# EAGLE design DeepReset2 (EAGLE 9.4.0)
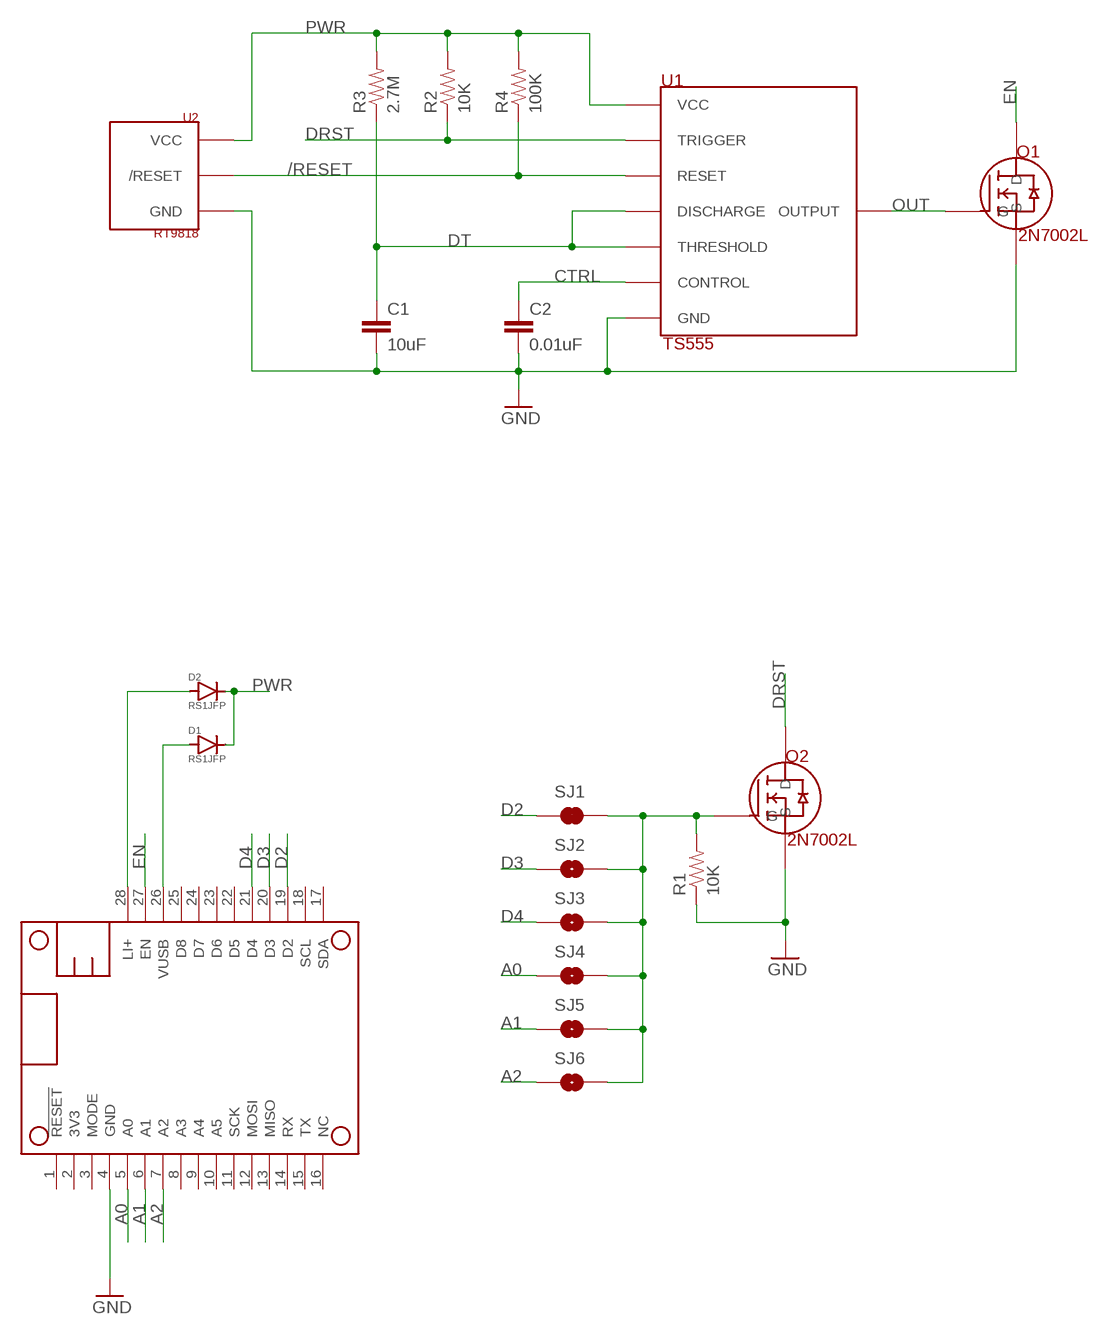
[diagram p0: schematic, sheet 1]

## Parts
C1  10uF  CAP-10UF-0603  [0603-CAP]
C2  0.01uF  CAP-0.01UF-0603  [0603-CAP]
D1  RS1JFP  DIODE-RS1JFP  [SOD-123HE-ON]
D2  RS1JFP  DIODE-RS1JFP  [SOD-123HE-ON]
MS1  FEATHERWING_NODIM  [FEATHERWING_NODIM]
Q1  2N7002L  [2N7002L]
Q2  2N7002L  [2N7002L]
R1  10K  RES-10K-06030603  [0603-RES]
R2  10K  RES-10K-06030603  [0603-RES]
R3  2.7M  RES-2.7M-0603  [0603-RES]
R4  100K  RES-100K-0603  [0603-RES]
SJ1  JUMPER-PAD-2-NC_BY_TRACENO_SILK  [PAD-JUMPER-2-NC_BY_TRACE_NO_SILK]
SJ2  JUMPER-PAD-2-NO  [PAD-JUMPER-2-NO_NO_SILK]
SJ3  JUMPER-PAD-2-NO  [PAD-JUMPER-2-NO_NO_SILK]
SJ4  JUMPER-PAD-2-NO  [PAD-JUMPER-2-NO_NO_SILK]
SJ5  JUMPER-PAD-2-NO  [PAD-JUMPER-2-NO_NO_SILK]
SJ6  JUMPER-PAD-2-NO  [PAD-JUMPER-2-NO_NO_SILK]
U1  TS555  [8-SOIC-MICROCHIP-3.9]
U2  RT9818  [SOT-23-3]

## Nets
/RESET: R4.1 U1.4(RESET) U2.1(/RESET)
A0: MS1.5(A0) SJ4.1
A1: MS1.6(A1) SJ5.1
A2: MS1.7(A2) SJ6.1
AD: Q2.1(G) R1.2 SJ1.2 SJ2.2 SJ3.2 SJ4.2 SJ5.2 SJ6.2
CTRL: C2.1 U1.5(CONTROL)
D2: MS1.19(D2) SJ1.1
D3: MS1.20(D3) SJ2.1
D4: MS1.21(D4) SJ3.1
DRST: Q2.3(D) R2.1 U1.2(TRIGGER)
DT: C1.1 R3.1 U1.6(THRESHOLD) U1.7(DISCHARGE)
EN: MS1.27(EN) Q1.3(D)
GND: C1.2 C2.2 MS1.4(GND) Q1.2(S) Q2.2(S) R1.1 U1.1(GND) U2.2(GND)
LI+: D2.2(ANODE) MS1.28(LI+)
OUT: Q1.1(G) U1.3(OUTPUT)
PWR: D1.1(CATHODE) D2.1(CATHODE) R2.2 R3.2 R4.2 U1.8(VCC) U2.3(VCC)
VUSB: D1.2(ANODE) MS1.26(VUSB)
Unconnected: MS1.1(!RESET) MS1.2(3V3) MS1.3(MODE) MS1.8(A3) MS1.9(A4) MS1.10(A5) MS1.11(SCK) MS1.12(MOSI) MS1.13(MISO) MS1.14(RX) MS1.15(TX) MS1.16(NC) MS1.17(SDA) MS1.18(SCL) MS1.22(D5) MS1.23(D6) MS1.24(D7) MS1.25(D8)

## Library data of the parts
C1 = rickk2:CAP-10UF-0603: CAP CER 10UF 16V X5R 0805 $ 0.21 https://www.digikey.com/product-detail/en/murata-electronics-north-america/GRM21BR61C106KE15L/490-3886-1-ND/965928
C2 = rickk2:CAP-0.01UF-0603: CAP CER 10000PF 100V X7R 0603 10000 pF = 10 nF = 0.01 uF https://www.digikey.com/product-detail/en/murata-electronics-north-america/GCM188R72A103KA37J/490-8028-1-ND/4380313
D1 D2 = rickk2:DIODE-RS1JFP: Reverse voltage protection diode ON Semiconductor RS1JFP $0.44 DIODE GP 600V 1.2A SOD123HE Diode Standard 600V 1.2A Surface Mount SOD-123HE https://www.digikey.com/product-detail/en/on-semiconductor/RS1JFP/RS1JFPCT-ND/5722970 Ordered 20 2019-04-01 Used in Ford open power supply 1=Cathode=Large Pad=side with band 2=Anode=Small Pad
MS1 = Particle-Mesh:FEATHERWING
Q1 Q2 = rickk2:2N7002L: MOSFET N-CH 60V 0.115A SOT-23 $ 0.16 On Semicondutor 2N7002LT1G N-Channel 115mA (Tc) 225mW (Ta) Surface Mount SOT-23-3 (TO-236) https://www.digikey.com/product-detail/en/on-semiconductor/2N7002LT3G/2N7002LT3GOSCT-ND/2704932 1=G, high=D is connected to S (GND), the "on" state 2=S to GND (bottom of symbol) 3=D to load (top of symbol, pin on the side by itself) 2A version: Diodes Inc DMN6075S-7 MOSFET N-CH 60V 2A SOT23-3 $0.45 https://www.digikey.com/product-detail/en/diodes-incorporated/DMN6075S-7/DMN6075S-7DICT-ND/5149299 Old: https://www.digikey.com/product-detail/en/on-semiconductor/2N7002LT1G/2N7002LT1GOSCT-ND/917791
R1 R2 = rickk2:RES-10K-0603: RES SMD 10K OHM 5% 1/4W 0603 $ 0.10 https://www.digikey.com/product-detail/en/panasonic-electronic-components/ERJ-PA3J103V/P10KBZCT-ND/5036237
R3 = rickk2:RES-2.7M-0603: Panasonic Electronic Components ERJ-3GEYJ275V RES SMD 2.7M OHM 5% 1/10W 0603 2.7 MOhms ±5% 0.1W, 1/10W Chip Resistor 0603 (1608 Metric) Automotive AEC-Q200 Thick Film https://www.digikey.com/product-detail/en/panasonic-electronic-components/ERJ-3GEYJ275V/P2.7MGCT-ND/282431
R4 = rickk2:RES-100K-0603: 100 kOhms ±1% 0.1W, 1/10W Chip Resistor 0603 (1608 Metric) Automotive AEC-Q200 Thick Film https://www.digikey.com/product-detail/en/panasonic-electronic-components/ERJ-3EKF1003V/P100KHCT-ND/198110 Old: RES SMD 100K OHM 1% 1/4W 0603 $ 0.16 Panasonic ERJ-PA3F1003V ±1% 0.25W, 1/4W Chip Resistor 0603 (1608 Metric) Automotive AEC-Q200, Pulse Withstanding Thick Film https://www.digikey.com/product-detail/en/panasonic-electronic-components/ERJ-PA3F1003V/P100KBYCT-ND/5036116
SJ1 = rickk2:JUMPER-PAD-2-NC_BY_TRACE
SJ2-SJ6 = rickk2:JUMPER-PAD-2-NO
U1 = rickk2:TS555: STMicroelectronics TS555IDTTR $1.12 IC OSC SINGLE TIMER 2.7MHZ 8SOIC 555 Type, Timer/Oscillator (Single) IC 2.7MHz 8-SO https://www.digikey.com/product-detail/en/stmicroelectronics/TS555IDTTR/497-16404-1-ND/5959811
U2 = rickk2:RT9818: Richtek USA Inc. RT9818C-29GV $0.41 IC VOLT DETECTOR 2.9V SOT23-3 Supervisor Open Drain or Open Collector 1 Channel SOT-23-3 https://www.digikey.com/product-detail/en/richtek-usa-inc/RT9818C-29GV/1028-1020-1-ND/2470079 RT9818C-29GV C = 220 ms /RESET 29 = 2.9V G=Green (Halogen and Pb Free) V = SOT23-3

## Board
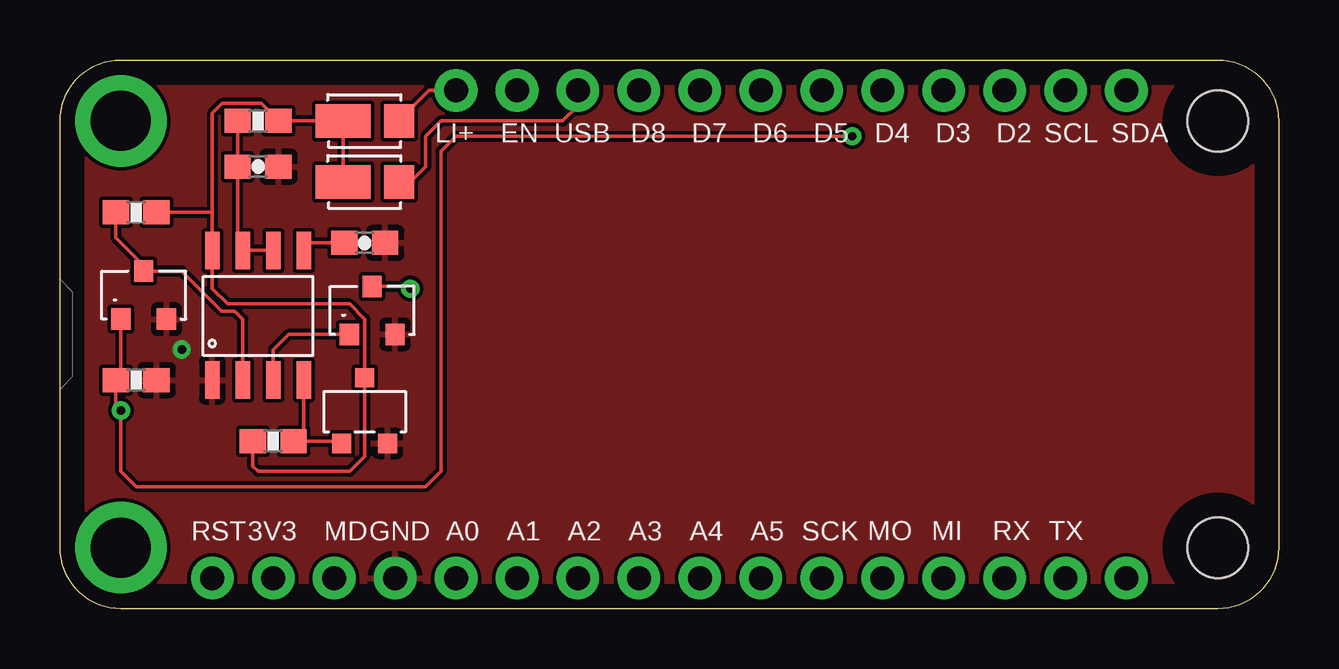
[diagram p1: board, top side]
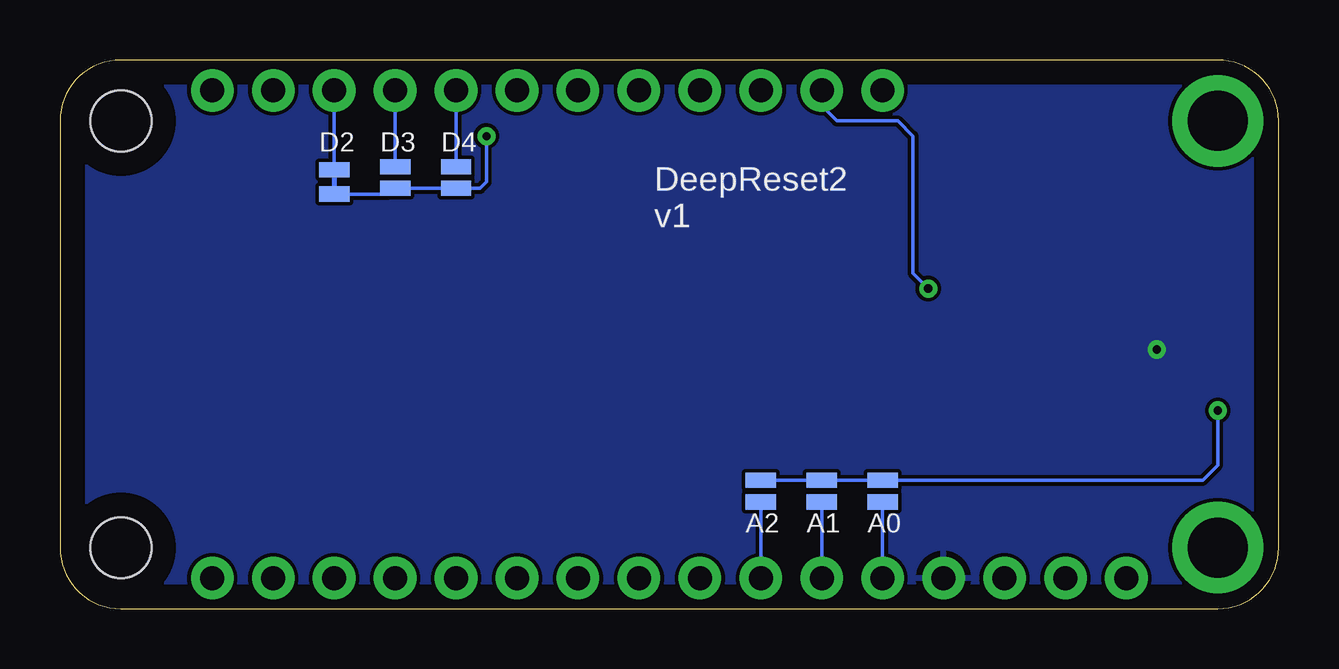
[diagram p2: board, bottom side, seen from below]

Size 50.8 x 22.86 mm. Coordinates in mm from the lower left corner, seen from the top.
Outline: 2.54,22.86 48.26,22.86 arc-90 50.8,20.32 50.8,2.54 arc-90 48.26,0 2.54,0 arc-90 0,2.54 0,20.32 arc-90 2.54,22.86
Copper layers (1*16): Top 0.035mm / dielectric 1.5mm / Bottom 0.035mm
Design rules "default": minimum track width 6mil, minimum drill 0.35mm, track to track 6mil, track to pad 6mil, pad to pad 6mil, via to via 6mil, smd to smd 6mil, copper to edge 40mil, drill to drill 6mil, minimum pad ring 10mil, minimum via ring 8mil, stop-mask expansion 4mil, vias tented up to drill 0mil, thermal gap 10mil

### Footprints (pad centres in the part's own frame; a part is rotated, then mirrored left to right if it is on the bottom)
0603-CAP = smd 1.1 x 1: 1 -0.85,0; 2 0.85,0
SOD-123HE-ON = smd 2.3 x 1.4: 1 -0.9,0 | smd 1.25 x 1.4: 2 1.425,0
FEATHERWING_NODIM = drill 1 pad 1.778: 1 6.35,1.27; 2 8.89,1.27; 3 11.43,1.27; 4 13.97,1.27; 5 16.51,1.27; 6 19.05,1.27; 7 21.59,1.27; 8 24.13,1.27; 9 26.67,1.27; 10 29.21,1.27; 11 31.75,1.27; 12 34.29,1.27; 13 36.83,1.27; 14 39.37,1.27; 15 41.91,1.27; 16 44.45,1.27; 17 44.45,21.59; 18 41.91,21.59; 19 39.37,21.59; 20 36.83,21.59; 21 34.29,21.59; 22 31.75,21.59; 23 29.21,21.59; 24 26.67,21.59; 25 24.13,21.59; 26 21.59,21.59; 27 19.05,21.59; 28 16.51,21.59 | drill 2.5 pad 3.81: P$1 2.54,20.32; P$2 2.54,2.54 | hole 2.54: 48.26,20.32; 48.26,2.54
2N7002L = smd 0.8 x 0.9: 1 0,0; 2 1.9,0; 3 0.95,2
0603-RES = smd 1.1 x 1: 1 -0.85,0; 2 0.85,0
PAD-JUMPER-2-NC_BY_TRACE_NO_SILK = smd 0.635 x 1.27: 1 -0.508,0; 2 0.508,0
PAD-JUMPER-2-NO_NO_SILK = smd 0.635 x 1.27: 1 -0.45,0; 2 0.45,0
8-SOIC-MICROCHIP-3.9 = smd 0.6 x 1.55: 1 0,0; 2 1.27,0; 3 2.54,0; 4 3.81,0; 5 3.81,5.4; 6 2.54,5.4; 7 1.27,5.4; 8 0,5.4
SOT-23-3 = smd 0.8 x 0.8: 1 -0.96,-1.37; 2 0.96,-1.37; 3 0,1.37

### Placement (x,y rotation side)
C1  8.26,18.41 0 top
C2  12.7,15.24 0 top
D1  12.7,17.78 0 top
D2  12.7,20.32 0 top
MS1  0,0 0 top
Q1  12.06,11.43 0 top
Q2  2.54,12.06 0 top
R1  3.17,9.53 180 top
R2  3.17,16.51 0 top
R3  8.26,20.32 0 top
R4  8.89,6.99 180 top
SJ1  39.37,17.78 270 bottom
SJ2  36.83,17.96 270 bottom
SJ3  34.29,17.96 270 bottom
SJ4  16.51,4.89 90 bottom
SJ5  19.05,4.89 90 bottom
SJ6  21.59,4.89 90 bottom
U1  6.35,9.53 0 top
U2  12.7,8.26 0 top

### Tracks (layer width: path | path; a pad name or v marks a point on that pad's centre or on a via)
/RESET
  Top 0.152: U2.1 11.64,6.99 R4.1 10.16,7.41 U1.4
A0
  Bottom 0.152: SJ4.1 MS1.5
A1
  Bottom 0.152: SJ5.1 MS1.6
A2
  Bottom 0.152: SJ6.1 MS1.7
AD  (via drill 0.35)
  Top 0.152: Q2.1 2.54,9.74 R1.2 2.33,8.47 v2.54,8.26 2.54,5.71 3.17,5.08 15.24,5.08 15.88,5.71 15.88,19.05 16.51,19.68 v33.02,19.68
  Bottom 0.152: SJ1.2 37.07,17.27 SJ2.2 SJ3.2 33.28,17.52 33.02,17.78 v33.02,19.68 | SJ6.2 SJ5.2 SJ4.2 3.17,5.34 2.54,5.98 v2.54,8.26
CTRL
  Top 0.152: U1.5 10.47,15.24 C2.1
D2
  Bottom 0.152: SJ1.1 MS1.19
D3
  Bottom 0.152: MS1.20 SJ2.1
D4
  Bottom 0.152: MS1.21 SJ3.1
DRST
  Top 0.152: R2.1 2.33,15.46 3.49,14.29 Q2.3 5.08,14.06 6.75,12.39 7.29,12.39 7.62,12.06 U1.2
DT
  Top 0.152: U1.6 U1.7 7.41,15.14 C1.1 R3.1
EN  (via drill 0.35)
  Top 0.152: Q1.3 14.51,13.43 v14.61,13.34
  Bottom 0.152: MS1.27 19.05,20.95 18.41,20.32 15.88,20.32 15.24,19.68 15.24,13.97 v14.61,13.34
GND  (via drill 0.35)
  other vias: 5.08,10.79
  pour Top: 0,0 0,25.4 53.34,25.4 53.34,0
  pour Bottom: 0,0 0,27.94 50.8,27.94 50.8,0
LI+
  Top 0.152: D2.2 15.39,21.59 MS1.28
OUT
  Top 0.152: Q1.1 9.53,11.43 8.89,10.79 U1.3
PWR
  Top 0.152: D1.1 D2.1 R3.2 8.38,21.05 6.76,21.05 6.35,20.64 6.35,16.51 | 6.35,16.51 U1.8 6.35,13.34 6.99,12.7 12.06,12.7 12.7,12.06 U2.3 12.7,6.35 12.06,5.71 8.26,5.71 8.04,5.93 R4.2 8.04,6.57 | R2.2 6.35,16.51
VUSB
  Top 0.152: MS1.26 21.59,20.95 20.95,20.32 15.88,20.32 15.24,19.68 15.24,18.41 14.61,17.78 D1.2

### Text on the board
tPlace: LI+ | EN | USB | D8 | D7 | D6 | D5 | D4 | D3 | D2 | SCL | SDA | RST | 3V3 | MD | GND | A0 | A1 | A2 | A3 | A4 | A5 | SCK | MO | MI | RX | TX
bPlace: D4 | D3 | D2 | DeepReset2 / v1 | A0 | A1 | A2